# EAGLE design van_pro (EAGLE 7.5.0)
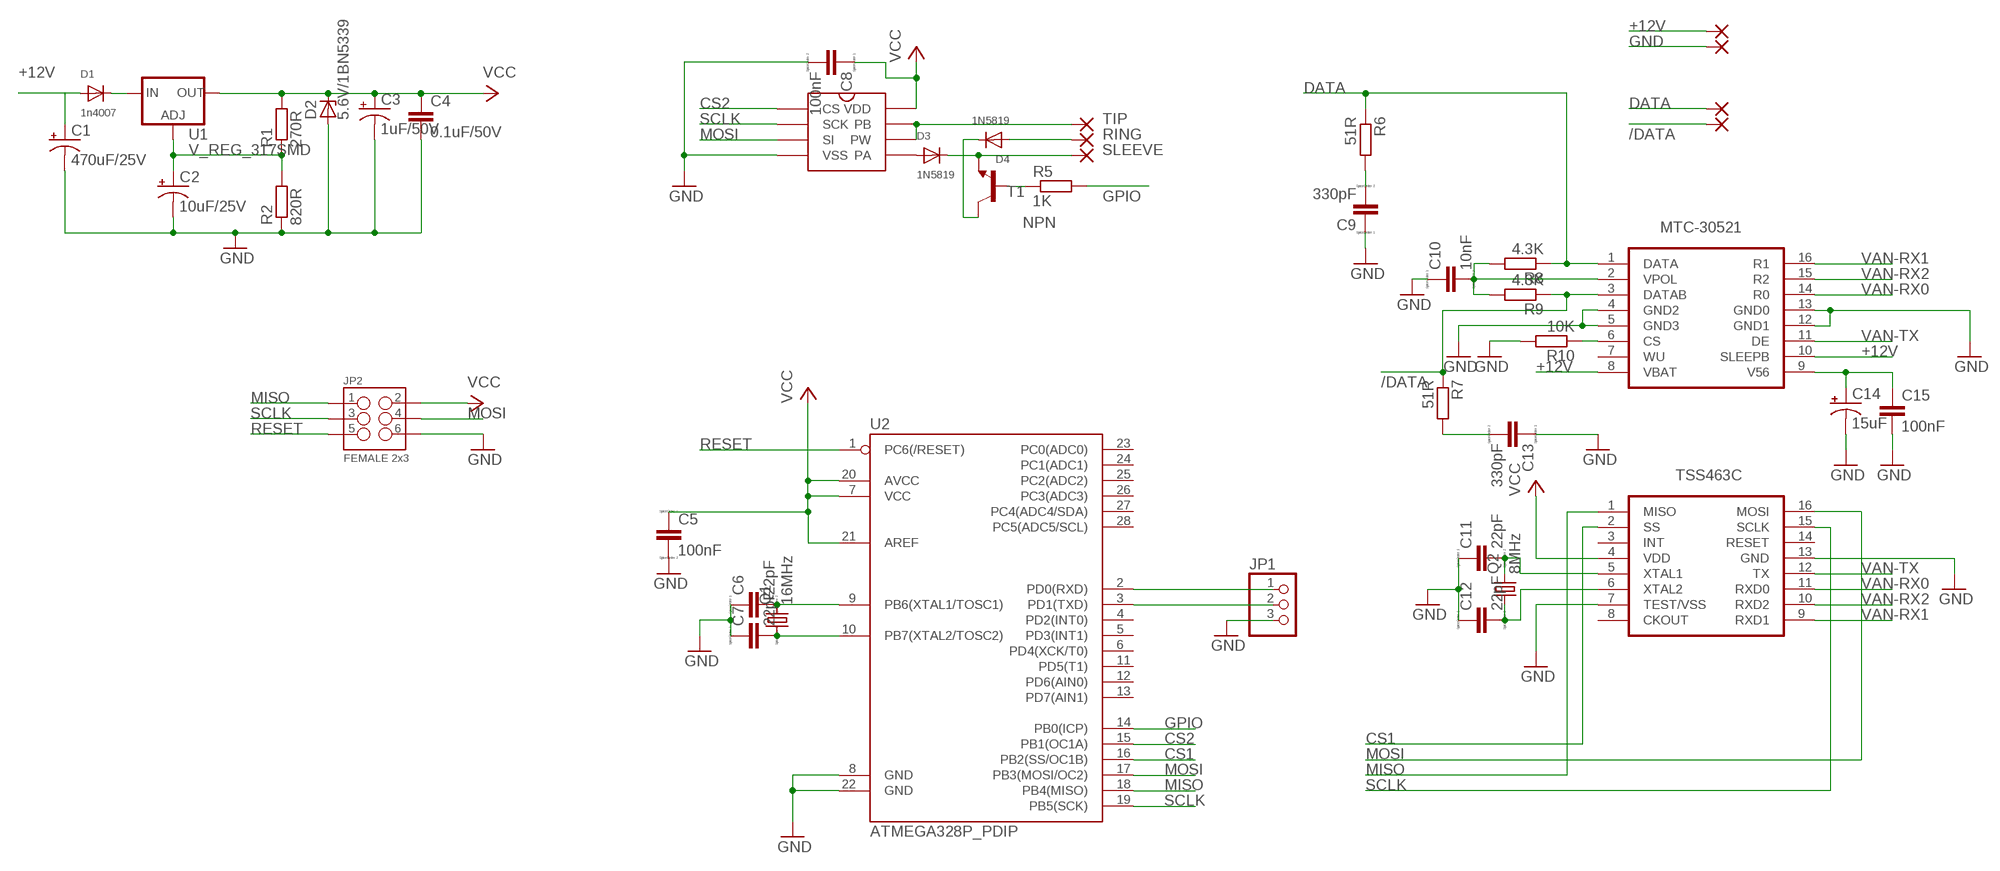
[diagram p0: schematic, sheet 1]

## Parts
12V  WIREPAD2,54/0,8  [2,54/0,8]
/DATA  WIREPAD2,54/0,8  [2,54/0,8]
C1  470uF/25V  CPOL-USE3.5-8  [E3,5-8]
C2  10uF/25V  CPOL-USE2-5  [E2-5]
C3  1uF/50V  CPOL-USE2-5  [E2-5]
C4  0.1uF/50V  C-EUC0805  [C0805]
C5  100nF  CC0603  [C0603]
C6  22pF  CC0603  [C0603]
C7  22pF  CC0603  [C0603]
C8  100nF  CC0603  [C0603]
C9  330pF  CC0603  [C0603]
C10  10nF  CC0603  [C0603]
C11  22pF  CC0603  [C0603]
C12  22pF  CC0603  [C0603]
C13  330pF  CC0603  [C0603]
C14  15uF  10UF-16V-10%(TANT)  [EIA3216]
C15  100nF  C-EUC1206  [C1206]
D1  1n4007  DIODESMA  [SMADIODE]
D2  5.6V/1BN5339  ZENER-DIODEDO41Z10  [DO41Z10]
D3  1N5819  DIODESMA  [SMADIODE]
D4  1N5819  DIODESMA  [SMADIODE]
DATA  WIREPAD2,54/0,8  [2,54/0,8]
GND  WIREPAD2,54/0,8  [2,54/0,8]
IC1  MCP41100  [SO8]
IC2  MTC-20521  [MTC-30521]
JP1  PINHD-1X3  [1X03]
JP2  FEMALE 2x3  M03X2FEMALE  [2X3]
Q1  16MHz  CRYSTALHC49UP  [HC49UP]
Q2  8MHz  CRYSTALHC49UP  [HC49UP]
R1  270R  R-EU_R0805  [R0805]
R2  820R  R-EU_R0805  [R0805]
R5  1K  R-EU_R0603  [R0603]
R6  51R  R-EU_R0603  [R0603]
R7  51R  R-EU_R0603  [R0603]
R8  4.3K  R-EU_R0603  [R0603]
R9  4.3K  R-EU_R0603  [R0603]
R10  10K  R-EU_R0603  [R0603]
RNG  1,6/0,8  [1,6/0,8]
SL  1,6/0,8  [1,6/0,8]
T1  NPN  -NPN-SOT23-EBC  [SOT23-EBC]
TIP  1,6/0,8  [1,6/0,8]
U1  V_REG_317SMD  [SOT223]
U2  ATMEGA328P_PDIP  [DIL28-3]
VAN1  TSS463C  [TSS463C]

## Nets
+12V [vcc]: 12V.1(P) C1.+ D1.A IC2.8(VBAT) IC2.10(SLEEPB)
/DATA: /DATA.1(P) IC2.3(DATAB) R7.1 R9.1
CS1: U2.16(PB2(SS/OC1B)) VAN1.2(SS)
CS2: IC1.1(CS) U2.15(PB1(OC1A))
DATA: DATA.1(P) IC2.1(DATA) R6.1 R8.1
GND [vcc]: C1.- C2.- C3.- C4.2 C5.2 C6.1 C7.1 C8.2 C9.1 C10.1 C11.1 C12.1 C13.1 C14.C(-) C15.2 D2.A GND.1(P) IC1.4(VSS) IC2.4(GND2) IC2.5(GND3) IC2.12(GND1) IC2.13(GND0) JP1.3 JP2.6 R2.1 R10.2 U2.8(GND) U2.22(GND) VAN1.7(TEST/VSS) VAN1.13(GND)
GPIO: R5.2 U2.14(PB0(ICP))
MISO: JP2.1 U2.18(PB4(MISO)) VAN1.1(MISO)
MOSI: IC1.3(SI) JP2.4 U2.17(PB3(MOSI/OC2)) VAN1.16(MOSI)
N$1: C11.2 Q2.2 VAN1.5(XTAL1)
N$2: D3.A IC1.5(PA)
N$3: D4.C T1.C
N$4: C6.2 Q1.2 U2.9(PB6(XTAL1/TOSC1))
N$5: C7.2 Q1.1 U2.10(PB7(XTAL2/TOSC2))
N$7: R5.1 T1.B
N$9: C12.2 Q2.1 VAN1.6(XTAL2)
N$10: C2.+ R1.1 R2.2 U1.1(ADJ)
N$16: D1.C U1.3(IN)
N$20: IC2.6(CS) R10.1
N$21 [vcc]: C10.2 IC2.2(VPOL) R8.2 R9.2
N$25: C13.2 R7.2
N$26: C9.2 R6.2
N$28: C14.A(+) C15.1 IC2.9(V56)
RESET: JP2.5 U2.1(PC6(/RESET))
RING: D4.A RNG.1(P)
RX: JP1.1 U2.2(PD0(RXD))
SCLK: IC1.2(SCK) JP2.3 U2.19(PB5(SCK)) VAN1.15(SCLK)
SLEEVE: D3.C SL.1(P) T1.E
TIP: IC1.6(PW) IC1.7(PB) TIP.1(P)
TX: JP1.2 U2.3(PD1(TXD))
VAN-RX0: IC2.14(R0) VAN1.11(RXD0)
VAN-RX1: IC2.16(R1) VAN1.9(RXD1)
VAN-RX2: IC2.15(R2) VAN1.10(RXD2)
VAN-TX: IC2.11(DE) VAN1.12(TX)
VCC [vcc5]: C3.+ C4.1 C5.1 C8.1 D2.C IC1.8(VDD) JP2.2 R1.2 U1.2(OUT) U2.7(VCC) U2.20(AVCC) U2.21(AREF) VAN1.4(VDD)
Unconnected: IC2.7(WU) U2.4(PD2(INT0)) U2.5(PD3(INT1)) U2.6(PD4(XCK/T0)) U2.11(PD5(T1)) U2.12(PD6(AIN0)) U2.13(PD7(AIN1)) U2.23(PC0(ADC0)) U2.24(PC1(ADC1)) U2.25(PC2(ADC2)) U2.26(PC3(ADC3)) U2.27(PC4(ADC4/SDA)) U2.28(PC5(ADC5/SCL)) VAN1.3(INT) VAN1.8(CKOUT) VAN1.14(RESET)

## Library data of the parts
12V /DATA DATA GND = wirepad:WIREPAD: Wire PAD connect wire on PCB
C1-C3 = adafruit:CPOL-US: POLARIZED CAPACITOR, American symbol
C4 = rcl:C-EU: CAPACITOR, European symbol
C5 C8 = eagle-ltspice:C: CAPACITOR, European symbol; OC_FARNELL: unknown; SPICEMODEL: NONE; SPICEPREFIX: C
C6 C7 C9-C13 = eagle-ltspice:C: CAPACITOR, European symbol; MF: AVX; MPN: 08052A220JAT2A; OC_FARNELL: 2332724; SPICEMODEL: NONE; SPICEPREFIX: C
C14 = SparkFun-Capacitors:10UF-16V-10%(TANT): CAP-00811 1206/EIA-3216 Tantalum capacitor; MF: AVX; MPN: 08052A220JAT2A; OC_FARNELL: 2332724; PROD_ID: CAP-00811; VALUE: 10uF
C15 = resistor:C-EU: CAPACITOR, European symbol; MF: AVX; MPN: 08052A220JAT2A; OC_FARNELL: 2332724
D1 = adafruit:DIODE: Diode SMADIODE - SMA Surface Mount Package 20V 1A Schottky Diode Digikey: 641-1014-6-ND DO-1N4148 - Through Hole Small Current Diode SOD-123 20V 1 A (.5mV Vf) Schottky Diode - Digikey: MBRX120TPMSCT-ND SOD-323 10V 570mA (.38mV Vf, 3ns) Schottky Diode - Digikey: ZLLS410CT-ND SOD-523 30V 30mA Schottky Diode (RB751S-40TE61) - Digikey: RB751S-40TE61CT-ND SOT23-R/W - SOT23 Package (R = Solder Paste/Reflow Ovens, W = Hand-Soldering) BAT54Film 40V 300mA - Digikey: 497-7162-1-ND
D2 = diode:ZENER-DIODE: Z-Diode
D3 D4 = adafruit:DIODE: Diode SMADIODE - SMA Surface Mount Package 20V 1A Schottky Diode Digikey: 641-1014-6-ND DO-1N4148 - Through Hole Small Current Diode SOD-123 20V 1 A (.5mV Vf) Schottky Diode - Digikey: MBRX120TPMSCT-ND SOD-323 10V 570mA (.38mV Vf, 3ns) Schottky Diode - Digikey: ZLLS410CT-ND SOD-523 30V 30mA Schottky Diode (RB751S-40TE61) - Digikey: RB751S-40TE61CT-ND SOT23-R/W - SOT23 Package (R = Solder Paste/Reflow Ovens, W = Hand-Soldering) BAT54Film 40V 300mA - Digikey: 497-7162-1-ND; OC_FARNELL: unknown
IC1 = MCP4100:MCP41100
IC2 = MTC-30521:MTC-20521; MF: MTC-30521
JP1 = pinhead:PINHD-1X3: PIN HEADER
JP2 = SparkFun-Connectors:M03X2: 2x3 .1" header. Shrouded, with keying- CONN-10681 SMT- CONN-11415 Pogo pins- HW-11044; PROD_ID: CONN-11566
Q1 Q2 = crystal:CRYSTAL: CRYSTAL; MF: MULTICOMP; MPN: HC49SM-3.6864-30-50-60-16-ATF; OC_FARNELL: unknown; OC_NEWARK: unknown
R1 R2 = rcl:R-EU_: RESISTOR, European symbol
R5-R10 = resistor:R-EU_: RESISTOR, European symbol; OC_FARNELL: unknown
RNG SL TIP = wirepad:1,6/0,8: THROUGH-HOLE PAD
T1 = transistor:*-NPN-: NPN Transistror BF959 corrected 2008.03.06
U1 = SparkFun-PowerIC:V_REG_317: Voltage Regulator Standard LM317 adjustable voltage regulator. AOI (Adjust Output Input). Google 'LM317 Calculator' for easy to use app to get the two resistor values needed. 240/720 for 5V output. 240/390 for 3.3V output. Spark Fun Electronics SKU : COM-00527
U2 = SparkFun-DigitalIC:ATMEGA328P_PDIP: uC used in the Arduino 32kb flash, 1k EEPROM, 2k SRAM This is the through-hole version of this chip.
VAN1 = TSS461F:TSS463C; MF: TSS463C; OC_FARNELL: unknown; PACKAGE: SO16

## Net classes
0 default: width 0.305 mm, drill 0.305 mm, clearance 0.305 mm
1 vcc: width 0.508 mm, drill 0.305 mm, clearance 0.406 mm
2 vcc5: width 0.508 mm, drill 0.305 mm, clearance 0.406 mm

## Board
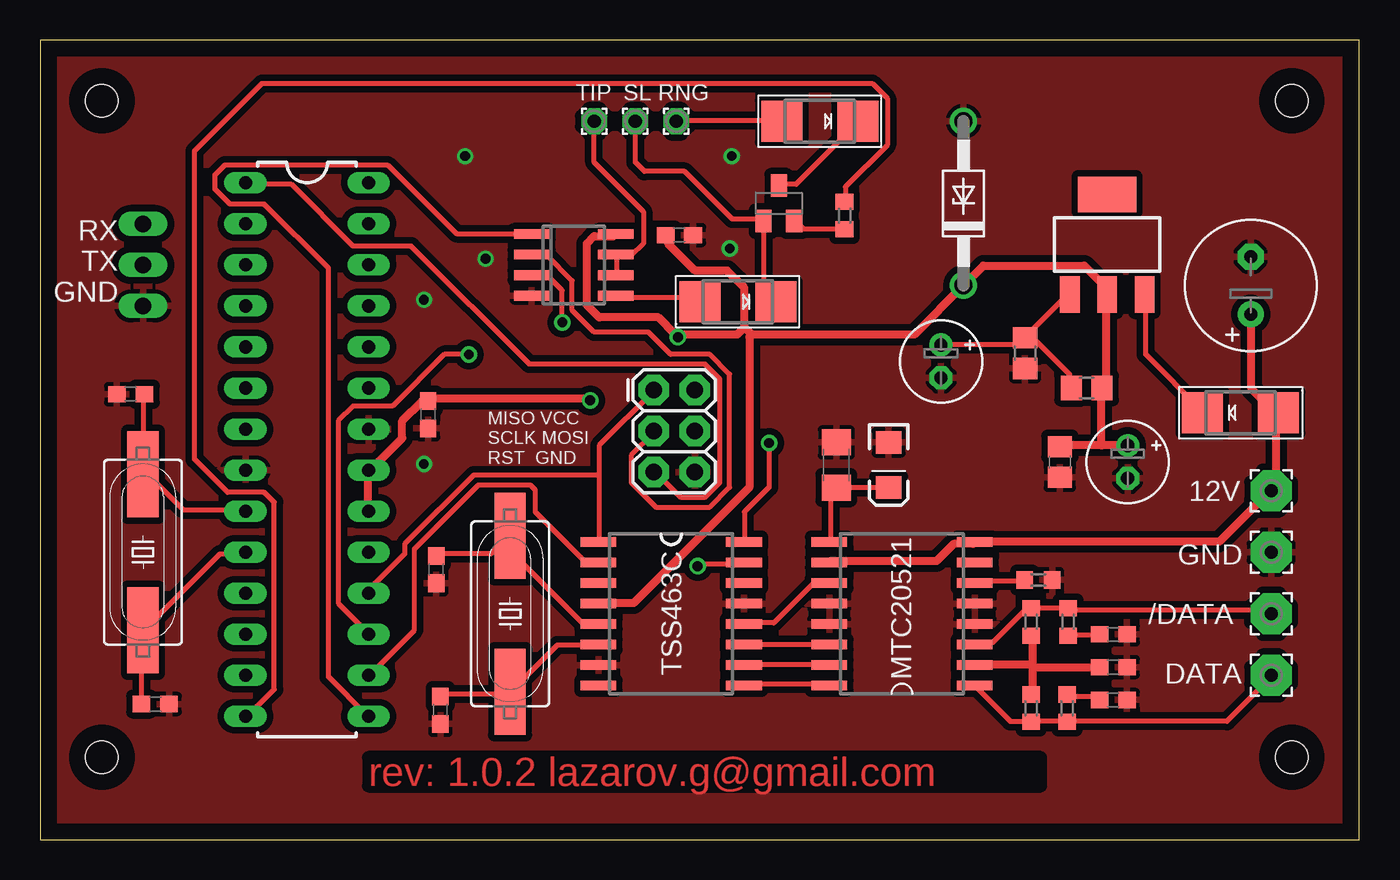
[diagram p1: board, top side]
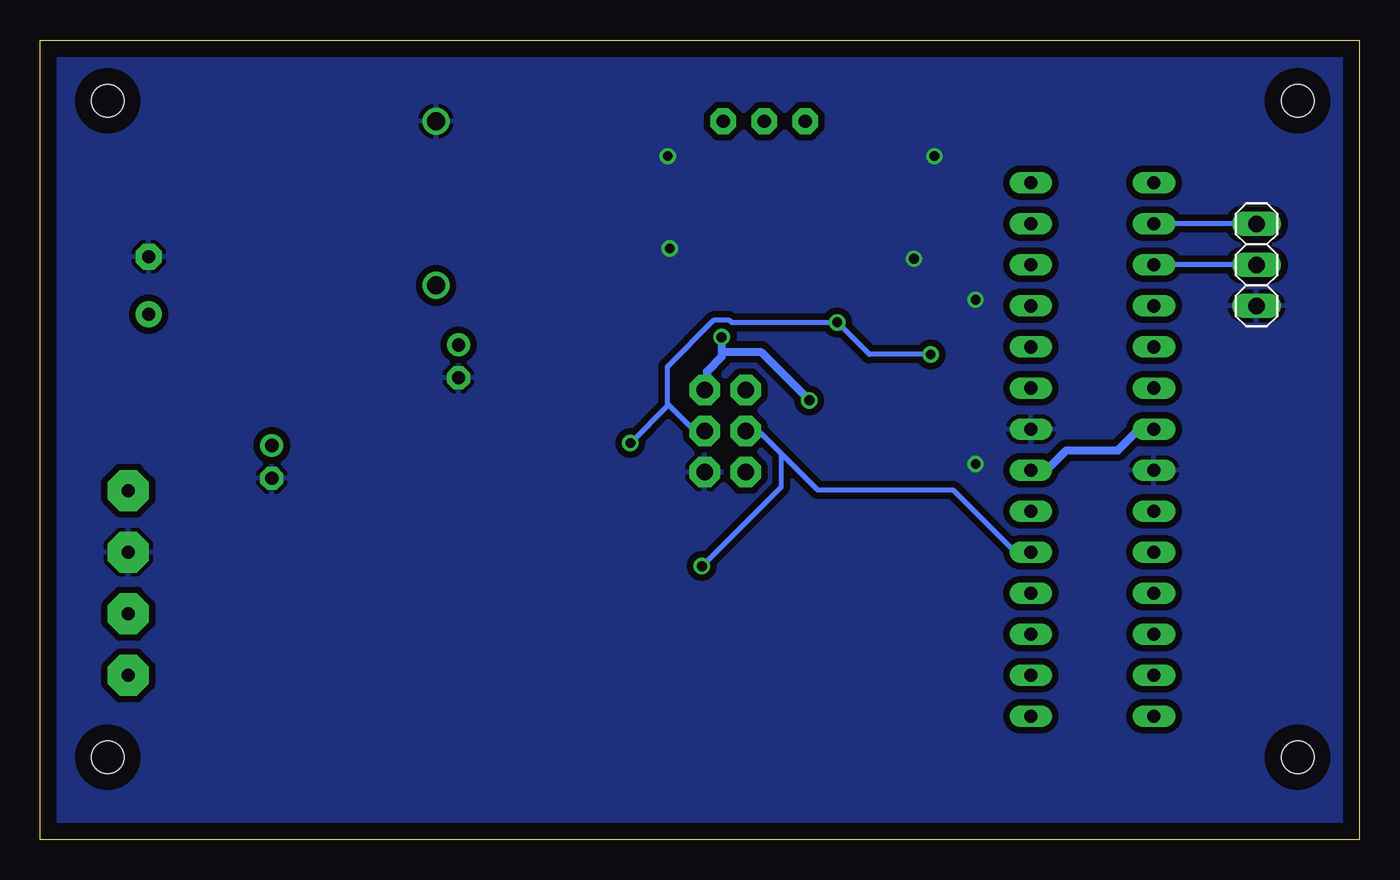
[diagram p2: board, bottom side, seen from below]

Size 81.64 x 49.45 mm. Coordinates in mm from the lower left corner, seen from the top.
Outline: 0,0 81.64,0 81.64,49.45 0,49.45 0,0
Copper layers (1*16): Top 0.035mm / dielectric 1.5mm / Bottom 0.035mm
Design rules "default": minimum track width 10mil, minimum drill 24mil, track to track 8mil, track to pad 8mil, pad to pad 8mil, via to via 8mil, smd to smd 8mil, copper to edge 40mil, drill to drill 8mil, minimum pad ring 10mil, minimum via ring 8mil, stop-mask expansion 4mil, vias tented up to drill 0mil, thermal gap 10mil
Holes 2 mm at 3.81,45.72 77.47,45.72 3.81,5.08 77.47,5.08

### Footprints (pad centres in the part's own frame; a part is rotated, then mirrored left to right if it is on the bottom)
2,54/0,8 = drill 0.813 pad 2.54 octagon: 1 0,0
E3,5-8 = drill 0.813 pad 1.6: + -1.778,0 | drill 0.813 pad 1.6 octagon: - 1.778,0
E2-5 = drill 0.813 pad 1.422: + -1.016,0 | drill 0.813 pad 1.422 octagon: - 1.016,0
C0805 = smd 1.3 x 1.5: 1 -0.95,0; 2 0.95,0
C0603 = smd 1.1 x 1: 1 -0.85,0; 2 0.85,0
EIA3216 = smd 1.4 x 1.6: A 1.4,0; C -1.4,0
C1206 = smd 1.6 x 1.8: 1 -1.4,0; 2 1.4,0
SMADIODE = smd 2.54 x 2.54: A 2.349,0; C -2.349,0
DO41Z10 = drill 1.118: A 5.08,0; C -5.08,0
SO8 = smd 0.6 x 2.2: 1 -1.905,-2.6; 2 -0.635,-2.6; 3 0.635,-2.6; 4 1.905,-2.6; 5 1.905,2.6; 6 0.635,2.6; 7 -0.635,2.6; 8 -1.905,2.6
MTC-30521 = smd 0.6 x 2.2: 1 -4.445,-5.14; 2 -3.175,-5.14; 3 -1.905,-5.14; 4 -0.635,-5.14; 5 0.635,-5.14; 6 1.905,-5.14; 7 3.175,-5.14; 8 4.445,-5.14; 9 4.445,3.87; 10 3.175,3.87; 11 1.905,3.87; 12 0.635,3.87; 13 -0.635,3.87; 14 -1.905,3.87; 15 -3.175,3.87; 16 -4.445,3.87
1X03 = drill 1.016 long: 1 -2.54,0; 2 0,0; 3 2.54,0
2X3 = drill 1.016 pad 1.88 octagon: 1 0,0; 2 0,2.54; 3 2.54,0; 4 2.54,2.54; 5 5.08,0; 6 5.08,2.54
HC49UP = smd 5.334 x 1.93: 1 -4.826,0; 2 4.826,0
R0805 = smd 1.3 x 1.5: 1 -0.95,0; 2 0.95,0
R0603 = smd 1 x 1.1: 1 -0.85,0; 2 0.85,0
1,6/0,8 = drill 0.813 pad 1.6 octagon: 1 0,0
SOT23-EBC = smd 1 x 1.4: B 0.95,-1.1; C 0,1.1; E -0.95,-1.1
SOT223 = smd 1.219 x 2.235: 1 -2.311,-3.099; 2 0,-3.099; 3 2.311,-3.099 | smd 3.6 x 2.2: 4 0,3.099
DIL28-3 = drill 0.813 long: 1 -16.51,-3.81; 2 -13.97,-3.81; 3 -11.43,-3.81; 4 -8.89,-3.81; 5 -6.35,-3.81; 6 -3.81,-3.81; 7 -1.27,-3.81; 8 1.27,-3.81; 9 3.81,-3.81; 10 6.35,-3.81; 11 8.89,-3.81; 12 11.43,-3.81; 13 13.97,-3.81; 14 16.51,-3.81; 15 16.51,3.81; 16 13.97,3.81; 17 11.43,3.81; 18 8.89,3.81; 19 6.35,3.81; 20 3.81,3.81; 21 1.27,3.81; 22 -1.27,3.81; 23 -3.81,3.81; 24 -6.35,3.81; 25 -8.89,3.81; 26 -11.43,3.81; 27 -13.97,3.81; 28 -16.51,3.81
TSS463C = smd 0.6 x 2.2: 1 1.905,1.21; 2 3.175,1.21; 3 4.445,1.21; 4 5.715,1.21; 5 6.985,1.21; 6 8.255,1.21; 7 9.525,1.21; 8 10.795,1.21; 9 10.795,10.22; 10 9.525,10.22; 11 8.255,10.22; 12 6.985,10.22; 13 5.715,10.22; 14 4.445,10.22; 15 3.175,10.22; 16 1.905,10.22

### Placement (x,y rotation side)
12V  76.2,21.59 0 top
/DATA  76.2,13.97 0 top
C1  74.93,34.29 90 top
C2  55.75,29.59 270 top
C3  67.31,23.37 270 top
C4  63.12,23.37 270 top
C5  24,26.29 270 top
C6  5.59,27.56 0 top
C7  7.11,8.38 180 top
C8  39.56,37.4 0 top
C9  66.42,8.64 180 top
C10  66.42,10.67 180 top
C11  24.51,16.7 90 top
C12  24.77,8 90 top
C13  66.42,12.7 180 top
C14  52.51,23.18 270 top
C15  49.28,23.18 90 top
D1  74.3,26.42 0 top
D2  57.15,39.37 90 top
D3  43.18,33.27 180 top
D4  48.26,44.45 180 top
DATA  76.2,10.16 0 top
GND  76.2,17.78 0 top
IC1  33.02,35.56 270 top
IC2  52.7,13.97 90 top
JP1  6.35,35.56 270 bottom
JP2  37.97,27.81 270 top
Q1  6.35,17.78 90 top
Q2  29.08,13.97 90 top
R1  64.77,27.94 0 top
R2  60.96,30.1 90 top
R5  49.78,38.61 90 top
R6  63.56,8.13 90 top
R7  63.63,13.46 270 top
R8  61.34,8.13 90 top
R9  61.34,13.46 270 top
R10  61.79,16.07 0 top
RNG  39.37,44.45 0 top
SL  36.83,44.45 0 top
T1  45.72,39.37 0 top
TIP  34.29,44.45 0 top
U1  66.04,36.83 0 top
U2  16.51,24.13 270 top
VAN1  33.34,20.32 270 top

### Tracks (layer width: path | path; a pad name or v marks a point on that pad's centre or on a via)
+12V
  Top 0.508: IC2.10 48.92,17.22 55.47,17.22 56.54,18.29 57.76,18.29 IC2.8 58.06,18.44 73,18.44 76.05,21.49 12V.1 76.2,21.64 76.5,21.95 76.5,26.36 D1.A 76.35,26.52 74.98,27.89 74.98,32.46 C1.+
/DATA
  Top 0.305: IC2.3 57.91,12.19 58.98,12.19 60.96,14.17 61.27,14.17 R9.1 61.42,14.33 63.55,14.33 R7.1 63.7,14.17 76.05,14.17 76.2,14.02 /DATA.1
CS1
  Top 0.305: VAN1.2 34.44,17.22 33.68,17.22 30.63,20.27 30.63,21.64 30.33,21.95 27.13,21.95 23.16,17.98 23.16,12.95 20.42,10.21 U2.16
CS2
  Top 0.305: IC1.1 30.33,37.49 25.76,37.49 21.49,41.76 11.43,41.76 10.82,41.15 10.82,40.23 11.73,39.32 13.87,39.32 17.83,35.36 17.83,10.06 20.27,7.62 U2.15
DATA
  Top 0.305: IC2.1 57.91,9.45 60.05,7.32 61.27,7.32 R8.1 61.42,7.32 63.55,7.32 R6.1 63.7,7.32 73.46,7.32 76.2,10.06 DATA.1
GND  (via drill 0.6)
  other vias: 27.56,35.94 42.67,36.58 23.75,23.24 26.29,42.29 23.75,33.4 42.8,42.29
  pour Top: -4.83,-4.06 88.39,-4.06 88.39,53.34 -4.83,53.34
  pour Bottom: -2.54,-2.54 85.09,-2.54 85.09,50.8 -2.54,50.8
GPIO
  Top 0.305: R5.2 49.84,39.47 49.84,40.39 52.43,42.98 52.43,45.87 51.51,46.79 13.72,46.79 9.55,42.62 9.55,23.52 11.58,21.49 13.87,21.49 14.48,20.88 14.48,9.3 12.8,7.62 U2.14
MISO
  Top 0.305: 34.59,22.55 34.59,24.38 37.95,27.74 JP2.1 | 34.59,22.55 34.59,18.44 VAN1.1 | 34.59,22.55 26.82,22.55 22.55,18.29 22.55,17.68 20.42,15.54 20.42,15.24 U2.18
MOSI  (via drill 0.6, 0.61)
  Top 0.305: v32.31,32 32.31,33.98 31.39,34.9 30.48,34.9 IC1.3 | v45.11,24.54 45.11,21.79 43.59,20.27 43.59,18.44 VAN1.16 | v26.52,30.02 24.99,30.02 21.79,26.82 19.36,26.82 18.44,25.91 18.44,14.63 20.27,12.8 U2.17
  Bottom 0.305: 42.75,26.9 41.15,25.3 40.54,25.3 JP2.4 | 42.75,26.9 42.82,26.98 42.82,29.26 39.93,32.16 39.01,32.16 38.86,32 v32.31,32 30.33,30.02 v26.52,30.02 | 42.75,26.9 v45.11,24.54
N$1
  Top 0.305: C11.2 24.54,17.68 27.89,17.68 28.96,18.75 Q2.2 28.65,18.29 33.53,13.41 34.44,13.41 VAN1.5
N$2
  Top 0.305: IC1.5 35.66,33.53 40.54,33.53 40.69,33.38 D3.A
N$3
  Top 0.305: T1.C 45.72,40.54 46.79,40.54 50.6,44.35 D4.C
N$4
  Top 0.305: C6.2 6.4,27.43 6.4,22.71 Q1.2 6.55,22.71 8.84,20.42 12.65,20.42 U2.9
N$5
  Top 0.305: C7.2 6.25,8.38 6.25,12.95 Q1.1 6.4,12.95 11.12,17.68 12.65,17.68 U2.10
N$7
  Top 0.305: R5.1 49.68,37.8 47.24,37.8 46.79,38.25 T1.B
N$9
  Top 0.305: C12.2 24.84,8.99 28.8,8.99 28.96,9.14 Q2.1 29.11,9.14 32,12.04 34.44,12.04 VAN1.6
N$10
  Top 0.305: R2.2 60.96,31.09 63.7,33.83 U1.1 | R1.1 63.7,28.04 63.7,28.8 61.27,31.24 R2.2 | C2.+ 55.78,30.63 60.66,30.63 60.96,30.94 R2.2
N$16
  Top 0.305: U1.3 68.43,33.68 68.43,30.02 71.93,26.52 D1.C
N$20
  Top 0.305: R10.1 60.81,16 57.91,16 IC2.6
N$21
  Top 0.508: 61.42,10.82 61.42,12.5 R9.2 | 61.42,10.82 61.42,10.67 | 61.42,10.67 61.42,8.99 R8.2 | 61.42,10.67 C10.2 | 61.42,10.82 57.91,10.82 IC2.2
N$25
  Top 0.305: R7.2 63.7,12.65 65.53,12.65 C13.2
N$26
  Top 0.305: R6.2 63.7,8.84 65.38,8.84 65.53,8.69 C9.2
N$28
  Top 0.305: C14.A 52.43,21.79 49.38,21.79 C15.1 49.23,21.64 48.92,21.34 48.92,18.44 IC2.9
RESET
  Top 0.305: U2.1 12.8,40.54 15.54,40.54 19.36,36.73 22.96,36.73 30.28,29.41 41.15,29.41 42.06,28.5 42.06,22.1 41.15,21.18 39.62,21.18 38.1,22.71 JP2.5
RING
  Top 0.305: D4.A 45.87,44.5 39.47,44.5 RNG.1
RX
  Bottom 0.305: JP1.1 U2.2
SCLK  (via drill 0.61)
  Top 0.305: v40.69,16.92 40.84,17.07 43.43,17.07 VAN1.15 | IC1.2 30.48,36.12 31.39,36.12 32.92,34.59 32.92,32.77 34.29,31.39 37.64,31.39 39.01,30.02 41.45,30.02 42.67,28.8 42.67,21.79 41.45,20.57 38.1,20.57 36.58,22.1 36.58,23.77 37.95,25.15 JP2.3
  Bottom 0.305: v40.69,16.92 35.76,21.84 35.76,23.88 | 35.76,23.88 37.03,25.15 37.95,25.15 JP2.3 | U2.19 20.42,17.83 21.34,17.83 25.15,21.64 33.53,21.64 35.76,23.88
SLEEVE
  Top 0.305: D3.C 45.41,33.38 44.81,33.98 44.81,38.25 T1.E 44.65,38.41 42.82,38.41 39.88,41.35 37.39,41.35 36.83,41.91 SL.1
TIP
  Top 0.305: IC1.6 35.66,35.05 35.66,36.12 IC1.7 35.81,36.12 36.58,36.12 37.34,36.88 37.34,38.86 34.29,41.91 TIP.1
TX
  Bottom 0.305: JP1.2 U2.3
VAN-RX0
  Top 0.305: VAN1.11 43.59,12.04 48.77,12.04 IC2.14
VAN-RX1
  Top 0.305: VAN1.9 43.59,9.6 48.77,9.6 IC2.16
VAN-RX2
  Top 0.305: VAN1.10 43.59,10.82 48.77,10.82 IC2.15
VAN-TX
  Top 0.305: VAN1.12 43.59,13.41 45.41,13.41 47.85,15.85 48.77,15.85 IC2.11
VCC  (via drill 0.61)
  Top 0.508: U2.20 20.27,20.42 20.27,22.71 U2.21 20.42,22.86 22.4,24.84 22.4,25.91 23.62,27.13 23.93,27.13 C5.1 24.23,27.28 34.14,27.28 v34.04,27.18 | C3.+ 65.68,24.38 | 65.68,24.38 63.25,24.38 C4.1 | 65.68,24.38 65.68,27.89 R1.2 65.84,28.04 65.99,28.19 65.99,33.68 U1.2 65.84,33.83 65.84,34.29 64.62,35.51 58.37,35.51 D2.C 54.1,31.24 44.04,31.24 | 43.59,31.7 43.59,34.14 42.52,35.2 40.54,35.2 38.86,36.88 38.86,37.34 C8.1 | 44.04,31.24 43.59,31.7 | VAN1.4 34.59,14.63 36.73,14.63 43.89,21.79 43.89,31.09 44.04,31.24 | 39.32,31.24 38.25,32.31 34.59,32.31 33.83,33.07 33.83,36.88 34.29,37.34 35.51,37.34 IC1.8 | 39.32,31.24 43.13,31.24 43.59,31.7 | v39.47,31.09 39.32,31.24
  Bottom 0.508: U2.21 19.36,22.86 18.14,24.08 14.94,24.08 13.72,25.3 12.8,25.3 U2.7 | v39.47,31.09 39.47,30.18 | 39.47,30.18 39.47,29.87 40.39,28.96 40.39,27.89 JP2.2 | v34.04,27.18 37.03,30.18 39.47,30.18

### Text on the board
Top: rev: 1.0.2 lazarov.g@gmail.com
tNames: RX / TX / GND | MISO VCC / SCLK MOSI / RST GND